# Altium schematic sheet Sht2-V12P0.SchDoc
size E; SheetNumber: 2; SheetTotal: 4
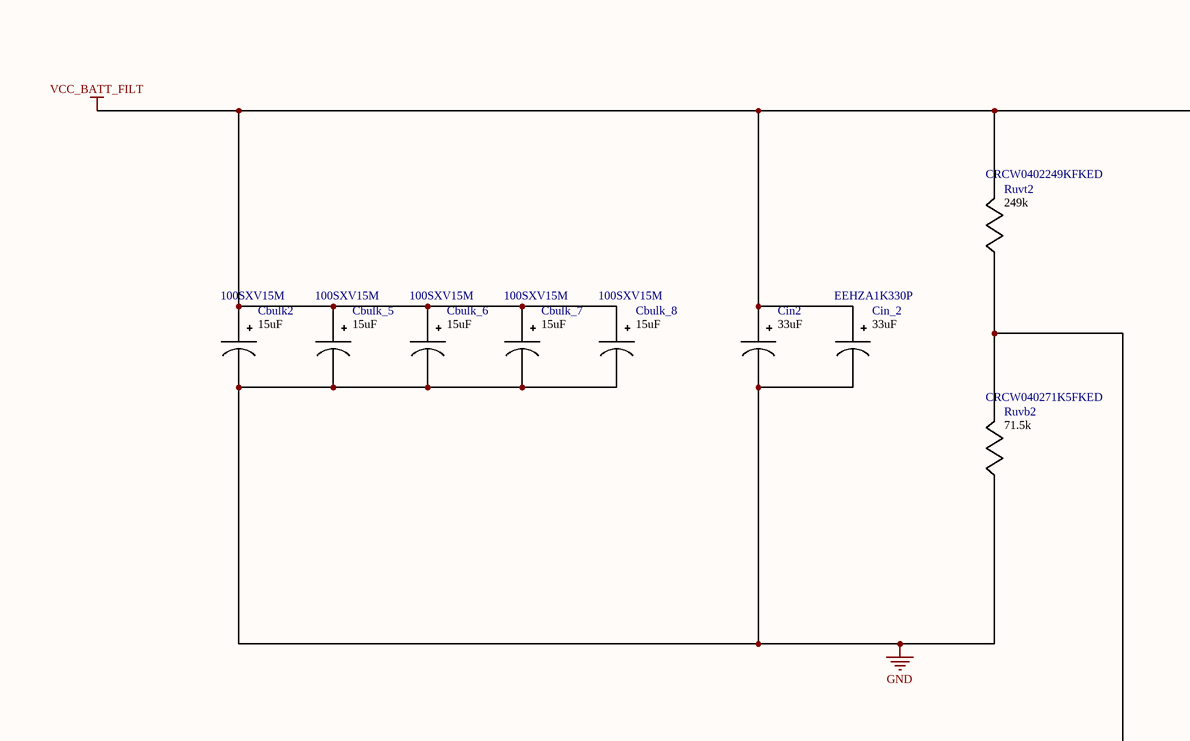
[diagram p0: Sht2-V12P0.SchDoc, top left]
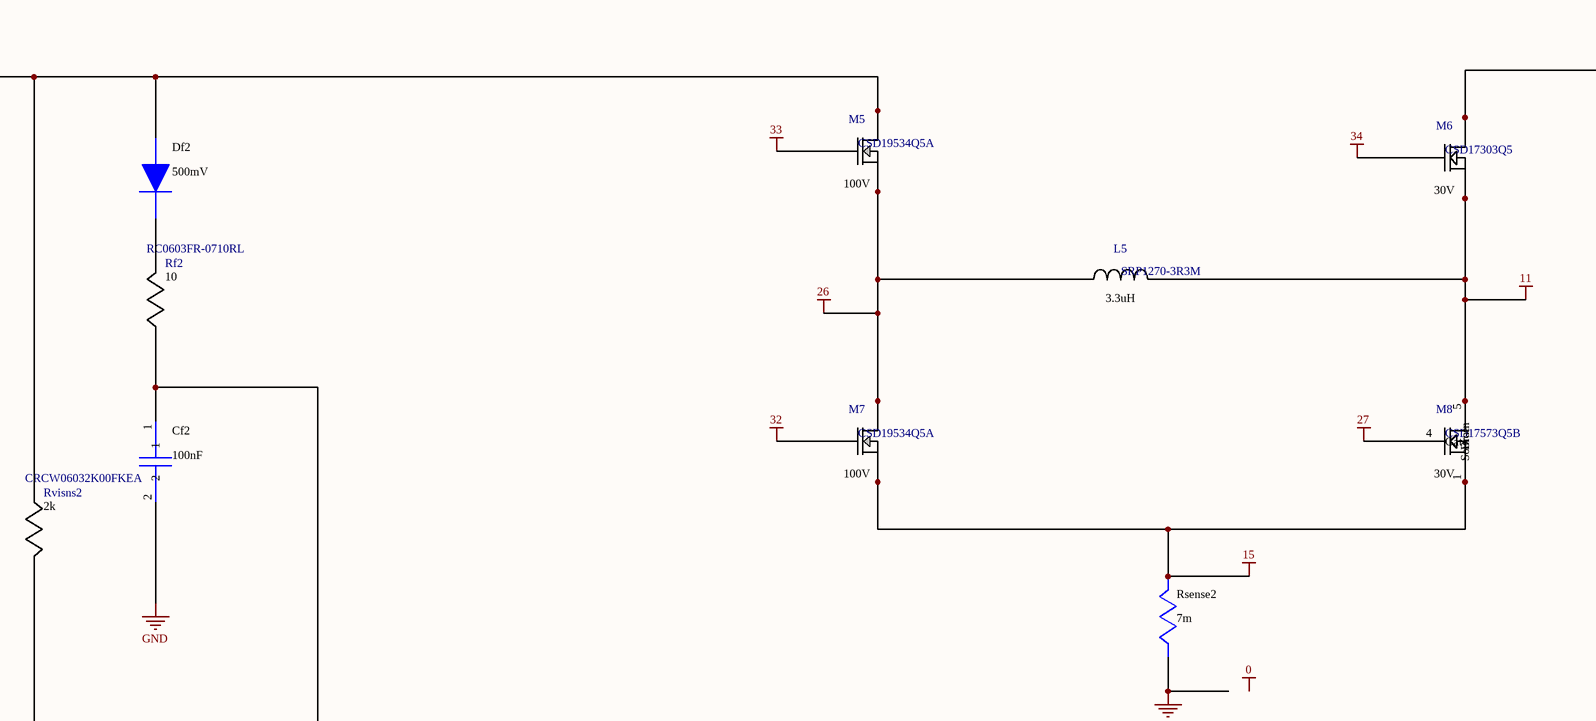
[diagram p1: Sht2-V12P0.SchDoc, top middle]
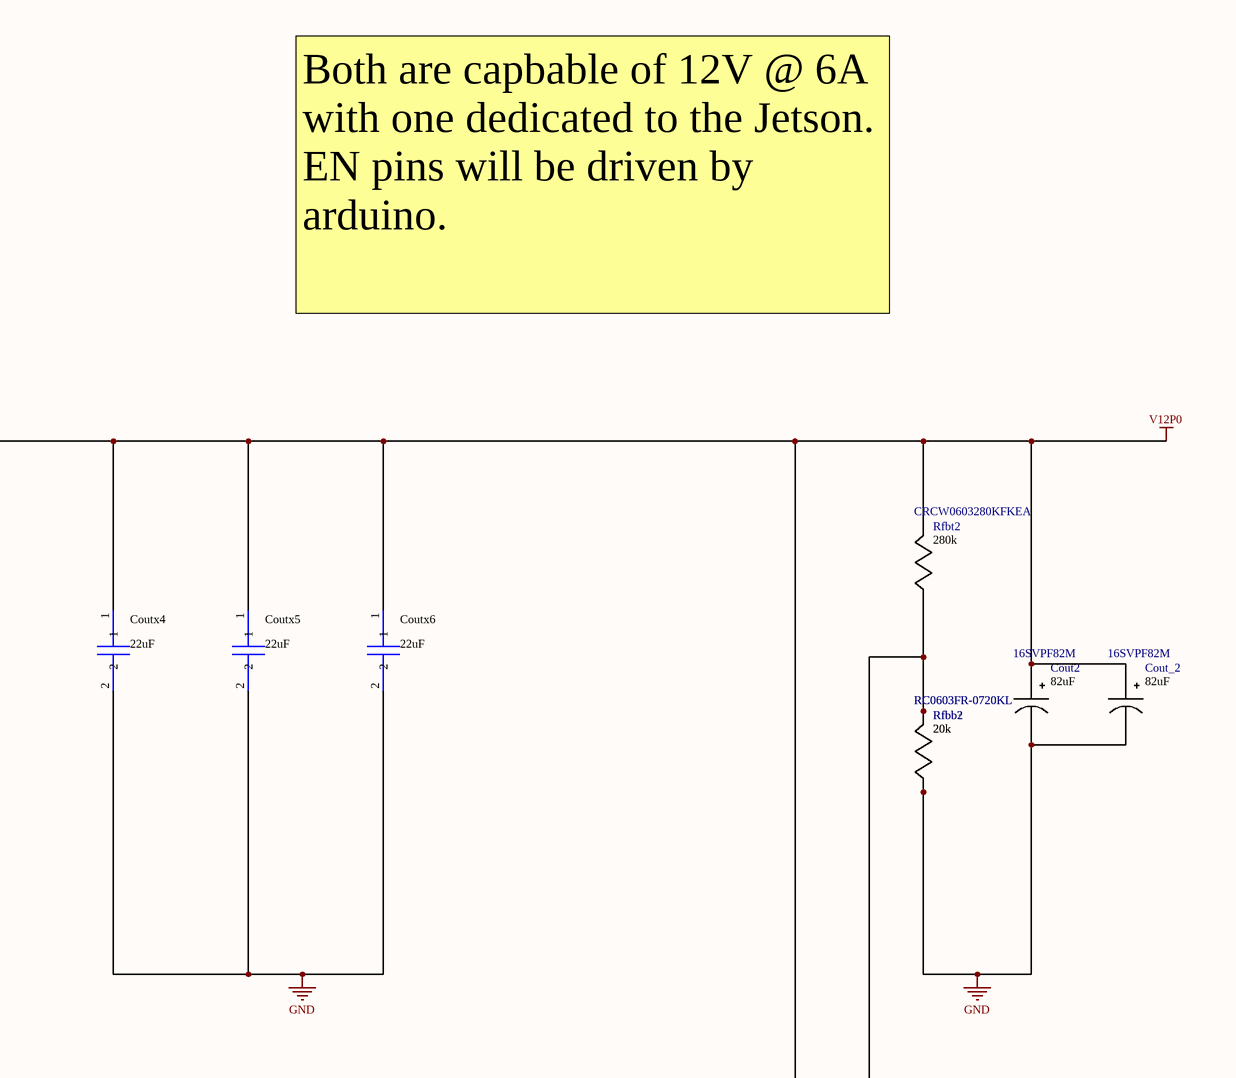
[diagram p2: Sht2-V12P0.SchDoc, top right]
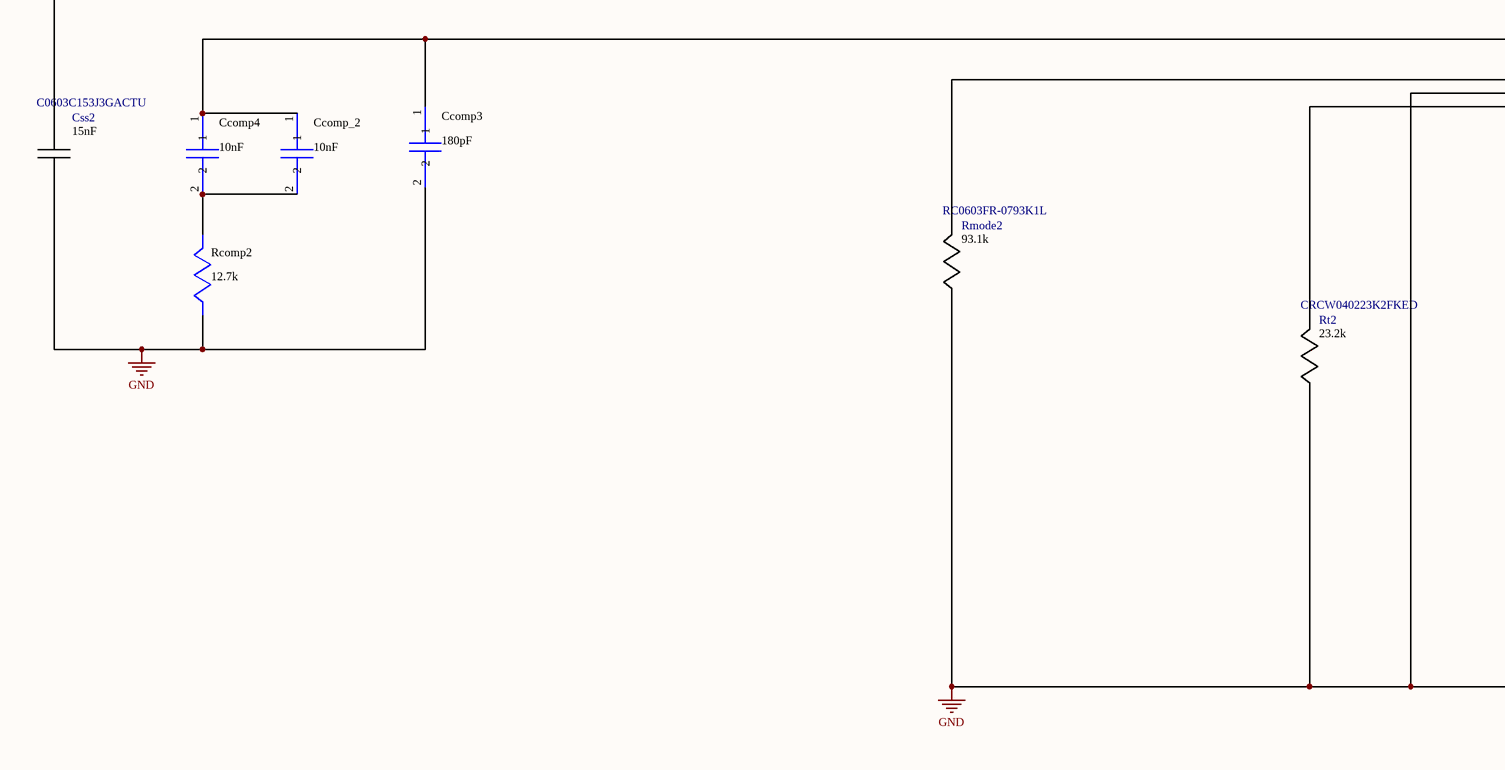
[diagram p3: Sht2-V12P0.SchDoc, bottom left]
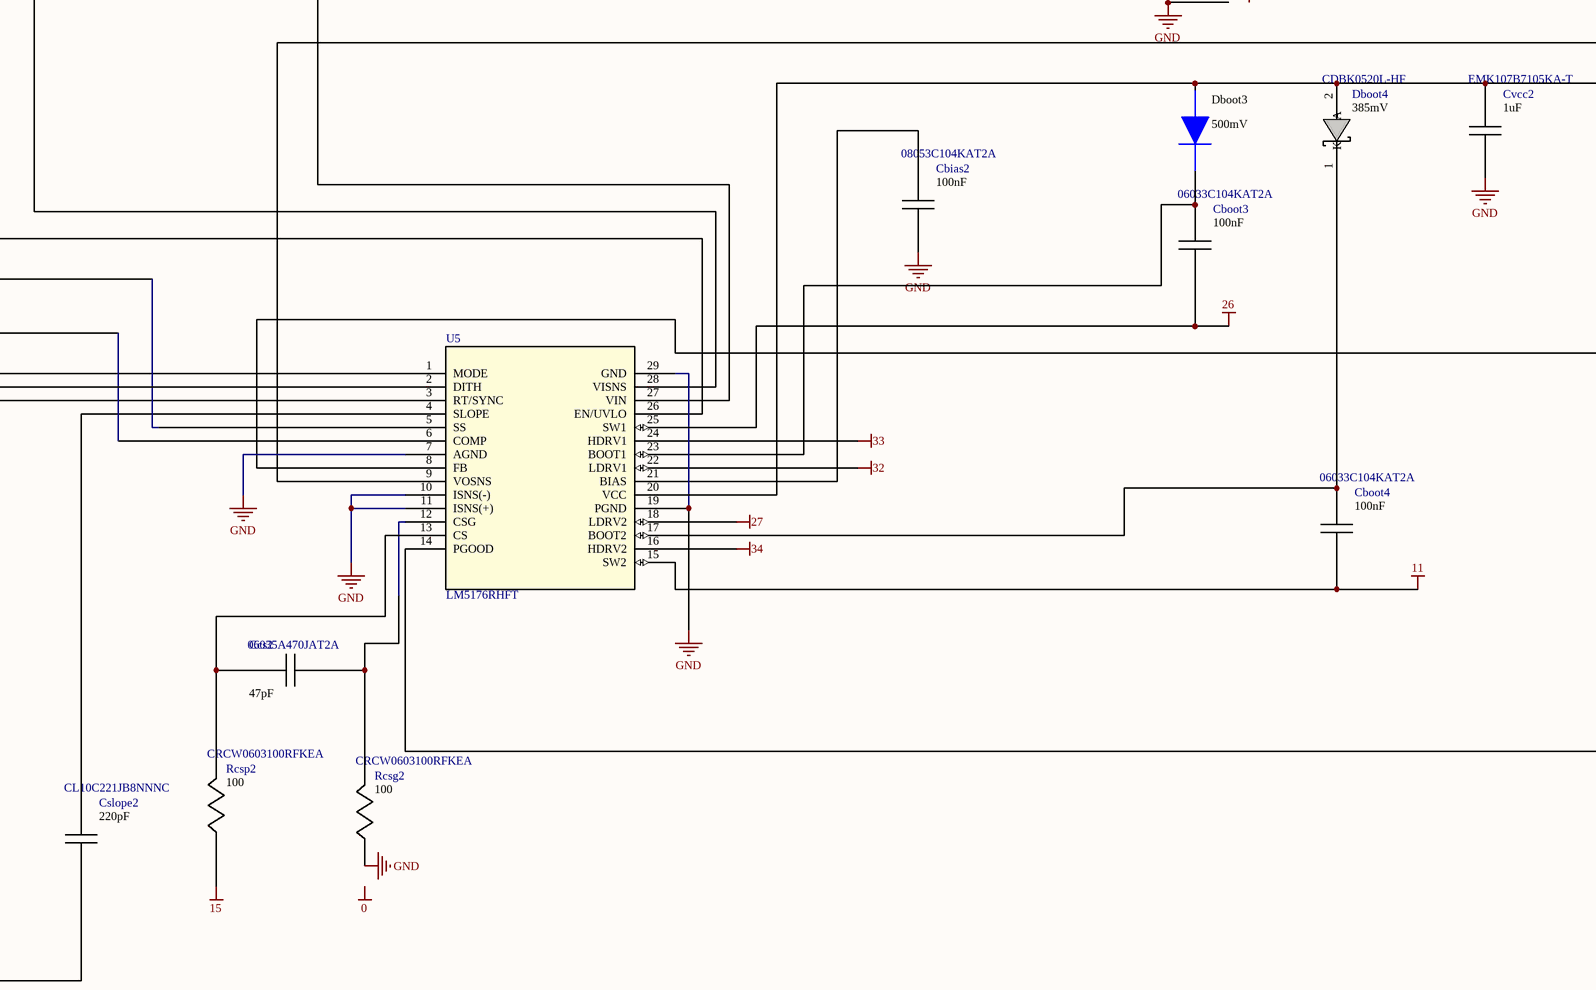
[diagram p4: Sht2-V12P0.SchDoc, bottom middle]
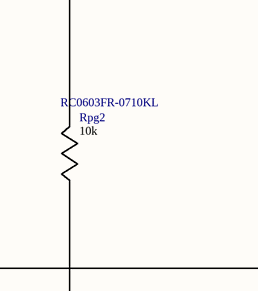
[diagram p5: Sht2-V12P0.SchDoc, bottom right]

## Parts
Cbias2  08053C104KAT2A  value 100nF  [0805]
Cboot3  06033C104KAT2A  value 100nF  [0603]
Cboot4  06033C104KAT2A  value 100nF  [0603]
Cbulk2  100SXV15M  value 15uF  [CAPSMT_62_E12]
Cbulk_5  100SXV15M  value 15uF  [CAPSMT_62_E12]
Cbulk_6  100SXV15M  value 15uF  [CAPSMT_62_E12]
Cbulk_7  100SXV15M  value 15uF  [CAPSMT_62_E12]
Cbulk_8  100SXV15M  value 15uF  [CAPSMT_62_E12]
Ccomp3  value 180pF  [0805]  (hidden comment: C0805C181K5GACTU)
Ccomp4  value 10nF  [0402]  (hidden comment: CGA2B3X7R1H103K050BB)
Ccomp_2  value 10nF  [0402]  (hidden comment: CGA2B3X7R1H103K050BB)
Ccs2  06035A470JAT2A  value 47pF  [0603]
Cf2  value 100nF  [0603]  (hidden comment: CGA3E2X7R1H104K080AA)
Cin2  value 33uF  [SM_RADIAL_10BMM]
Cin_2  EEHZA1K330P  value 33uF  [SM_RADIAL_10BMM]
Cout2  16SVPF82M  value 82uF  [CAPSMT_62_E61]
Cout_2  16SVPF82M  value 82uF  [CAPSMT_62_E61]
Coutx4  value 22uF  [0805]  (hidden comment: C2012X5R1V226M125AC)
Coutx5  value 22uF  [0805]  (hidden comment: C2012X5R1V226M125AC)
Coutx6  value 22uF  [0805]  (hidden comment: C2012X5R1V226M125AC)
Cslope2  CL10C221JB8NNNC  value 220pF  [0603]
Css2  C0603C153J3GACTU  value 15nF  [0603]
Cvcc2  EMK107B7105KA-T  value 1uF  [0603]
Dboot3  value 500mV  [GEN_Diode]  (hidden comment: GENERIC_DIODE)
Dboot4  CDBK0520L-HF  value 385mV  [SOD-123F]
Df2  value 500mV  [GEN_Diode]  (hidden comment: GENERIC_DIODE)
L5  SRP1270-3R3M  value 3.3uH  [SRP1270]
M5  CSD19534Q5A  value 100V  [TRANS_NexFET_Q5A]
M6  CSD17303Q5  value 30V  [TRANS_NexFET_Q5]
M7  CSD19534Q5A  value 100V  [TRANS_NexFET_Q5A]
M8  CSD17573Q5B  value 30V  [DNK0008A]
Rcomp2  value 12.7k  [0402]  (hidden comment: CRCW040212K7FKED)
Rcsg2  CRCW0603100RFKEA  value 100  [0603]
Rcsp2  CRCW0603100RFKEA  value 100  [0603]
Rf2  RC0603FR-0710RL  value 10  [0603]
Rfbb2  RC0603FR-0720KL  value 20k  [0603]
Rfbb?  RC0603FR-0720KL  value 20k  [0603]
Rfbt2  CRCW0603280KFKEA  value 280k  [0603]
Rmode2  RC0603FR-0793K1L  value 93.1k  [0603]
Rpg2  RC0603FR-0710KL  value 10k  [0603]
Rsense2  value 7m  [4527]  (hidden comment: WSR37L000FEA)
Rt2  CRCW040223K2FKED  value 23.2k  [0402]
Ruvb2  CRCW040271K5FKED  value 71.5k  [0402]
Ruvt2  CRCW0402249KFKED  value 249k  [0402]
Rvisns2  CRCW06032K00FKEA  value 2k  [0603]
U5  LM5176RHFT  [VQFN_76RHFT_TEX]

## Nets
11: Cboot4.2 L5.2 M6.1(Source) M6.2(Source) M6.3(Source) M8.5(Drain) M8.6(Drain) M8.7(Drain) M8.8(Drain) M8.9(Drain) U5.15(SW2)
15: M7.1(Source) M7.2(Source) M7.3(Source) M8.1(Source) M8.2(Source) M8.3(Source) Rcsp2.2 Rsense2.1
26: Cboot3.2 L5.1 M5.1(Source) M5.2(Source) M5.3(Source) M7.5(Drain) M7.6(Drain) M7.7(Drain) M7.8(Drain) M7.9(Drain) U5.25(SW1)
27: M8.4(Gate) U5.18(LDRV2)
32: M7.4(Gate) U5.22(LDRV1)
33: M5.4(Gate) U5.24(HDRV1)
34: M6.4(Gate) U5.16(HDRV2)
GND: Cbias2.2 Cbulk2.2(-) Cbulk_5.2(-) Cbulk_6.2(-) Cbulk_7.2(-) Cbulk_8.2(-) Ccomp3.2 Cf2.2 Cin2.2(-) Cin_2.2(-) Cout2.2(-) Cout_2.2(-) Coutx4.2 Coutx5.2 Coutx6.2 Cslope2.2 Css2.2 Cvcc2.2 Rcomp2.2 Rcsg2.2 Rfbb2.2 Rfbb?.2 Rmode2.2 Rsense2.2 Rt2.2 Ruvb2.2 U5.2(DITH) U5.7(AGND) U5.10(ISNS(-)) U5.11(ISNS(+)) U5.19(PGND) U5.29(GND)
V12P0: Cout2.1(+) Cout_2.1(+) Coutx4.1 Coutx5.1 Coutx6.1 M6.5(Drain) M6.6(Drain) M6.7(Drain) M6.8(Drain) M6.9(Drain) Rfbt2.1 U5.9(VOSNS)
VCC_BATT_FILT: Cbulk2.1(+) Cbulk_5.1(+) Cbulk_6.1(+) Cbulk_7.1(+) Cbulk_8.1(+) Cin2.1(+) Cin_2.1(+) Df2.2(A) M5.5(Drain) M5.6(Drain) M5.7(Drain) M5.8(Drain) M5.9(Drain) Ruvt2.1 Rvisns2.2
NetCbias2_1: Cbias2.1 U5.21(BIAS)
NetCboot3_1: Cboot3.1 Dboot3.1(K) U5.23(BOOT1)
NetCboot4_1: Cboot4.1 Dboot4.1(K) U5.17(BOOT2)
NetCcomp3_1: Ccomp3.1 Ccomp4.1 Ccomp_2.1 U5.6(COMP)
NetCcomp4_2: Ccomp4.2 Ccomp_2.2 Rcomp2.1
NetCcs2_1: Ccs2.1 Rcsp2.1 U5.13(CS)
NetCcs2_2: Ccs2.2 Rcsg2.1 U5.12(CSG)
NetCf2_1: Cf2.1 Rf2.2 U5.27(VIN)
NetCslope2_1: Cslope2.1 U5.4(SLOPE)
NetCss2_1: Css2.1 U5.5(SS)
NetCvcc2_1: Cvcc2.1 Dboot3.2(A) Dboot4.2(A) Rpg2.1 U5.20(VCC)
NetDf2_1: Df2.1(K) Rf2.1
NetRfbb2_1: Rfbb2.1 Rfbb?.1 Rfbt2.2 U5.8(FB)
NetRmode2_1: Rmode2.1 U5.1(MODE)
NetRpg2_2: Rpg2.2 U5.14(PGOOD)
NetRt2_1: Rt2.1 U5.3(RT/SYNC)
NetRuvb2_1: Ruvb2.1 Ruvt2.2 U5.26(EN/UVLO)
NetRvisns2_1: Rvisns2.1 U5.28(VISNS)

## Notes on the sheet
- Both are capbable of 12V @ 6A with one dedicated to the Jetson. EN pins will be driven by arduino.
- Labels drawn without touching a wire or pin: 0

## Library data of the parts
Cbias2 = 08053C104KAT2A: Manufacturer Name: AVX; PackageReference: 08053C104KAT2A; Manufacturer Part Number: 08053C104KAT2A
Cboot3 Cboot4 = 06033C104KAT2A: Manufacturer Name: AVX; PackageReference: 06033C104KAT2A; Manufacturer Part Number: 06033C104KAT2A
Cbulk2 Cbulk_5-Cbulk_8 = 100SXV15M: Manufacturer Name: Panasonic; PackageReference: 100SXV15M; Manufacturer Part Number: 100SXV15M
Ccomp3 = C0805C181K5GACTU: Manufacturer Name: Kemet; PackageReference: C0805C181K5GACTU; Manufacturer Part Number: C0805C181K5GACTU
Ccomp4 Ccomp_2 = CGA2B3X7R1H103K050BB: CGA2B3X7R1H103K0; Manufacturer Name: TDK; PackageReference: CGA2B3X7R1H103K050BB; Manufacturer Part Number: CGA2B3X7R1H103K050BB
Ccs2 = 06035A470JAT2A: Manufacturer Name: AVX; PackageReference: 06035A470JAT2A; Manufacturer Part Number: 06035A470JAT2A
Cf2 = CGA3E2X7R1H104K080AA: CGA3E2X7R1H104K0; Manufacturer Name: TDK; PackageReference: CGA3E2X7R1H104K080AA; Manufacturer Part Number: CGA3E2X7R1H104K080AA
Cin2 Cin_2 = EEHZA1K330P: Manufacturer Name: Panasonic; PackageReference: EEHZA1K330P; Manufacturer Part Number: EEHZA1K330P
Cout2 Cout_2 = 16SVPF82M: Manufacturer Name: Panasonic; PackageReference: 16SVPF82M; Manufacturer Part Number: 16SVPF82M
Coutx4-Coutx6 = C2012X5R1V226M125AC: C2012X5R1V226M12; Manufacturer Name: TDK; PackageReference: C2012X5R1V226M125AC; Manufacturer Part Number: C2012X5R1V226M125AC
Cslope2 = CL10C221JB8NNNC: Manufacturer Name: Samsung Electro-Mechanics; PackageReference: CL10C221JB8NNNC; Manufacturer Part Number: CL10C221JB8NNNC
Css2 = C0603C153J3GACTU: Manufacturer Name: Kemet; PackageReference: C0603C153J3GACTU; Manufacturer Part Number: C0603C153J3GACTU
Cvcc2 = EMK107B7105KA-T: Manufacturer Name: Taiyo Yuden; PackageReference: EMK107B7105KA-T; Manufacturer Part Number: EMK107B7105KA-T
Dboot3 = GENERIC_DIODE: CUSTOM1; Manufacturer Name: CUSTOM; PackageReference: CUSTOM; Manufacturer Part Number: GENERIC_DIODE
Dboot4 = CDBK0520L-HF: Manufacturer Name: Comchip Technology; PackageReference: CDBK0520L-HF; Manufacturer Part Number: CDBK0520L-HF
Df2 = GENERIC_DIODE: CUSTOM2; Manufacturer Name: CUSTOM; PackageReference: CUSTOM; Manufacturer Part Number: GENERIC_DIODE
L5 = SRP1270-3R3M: Manufacturer Name: Bourns; PackageReference: SRP1270-3R3M; Manufacturer Part Number: SRP1270-3R3M
M5 M7 = CSD19534Q5A: Manufacturer Name: Texas Instruments; PackageReference: CSD19534Q5A; Manufacturer Part Number: CSD19534Q5A
M6 = CSD17303Q5: Manufacturer Name: Texas Instruments; PackageReference: CSD17303Q5; Manufacturer Part Number: CSD17303Q5
M8 = CSD17573Q5B: CSD17573Q5B- Note out of stock, double check available subs; Manufacturer Name: Texas Instruments; PackageReference: CSD17573Q5B; Manufacturer Part Number: CSD17573Q5B
Rcomp2 = CRCW040212K7FKED: Manufacturer Name: Vishay-Dale; PackageReference: CRCW040212K7FKED; Manufacturer Part Number: CRCW040212K7FKED
Rcsg2 Rcsp2 = CRCW0603100RFKEA: Manufacturer Name: Vishay-Dale; PackageReference: CRCW0603100RFKEA; Manufacturer Part Number: CRCW0603100RFKEA
Rf2 = RC0603FR-0710RL: Manufacturer Name: Yageo; PackageReference: RC0603FR-0710RL; Manufacturer Part Number: RC0603FR-0710RL
Rfbb2 Rfbb? = RC0603FR-0720KL: Manufacturer Name: Yageo; PackageReference: RC0603FR-0720KL; Manufacturer Part Number: RC0603FR-0720KL
Rfbt2 = CRCW0603280KFKEA: Manufacturer Name: Vishay-Dale; PackageReference: CRCW0603280KFKEA; Manufacturer Part Number: CRCW0603280KFKEA
Rmode2 = RC0603FR-0793K1L: Manufacturer Name: Yageo; PackageReference: RC0603FR-0793K1L; Manufacturer Part Number: RC0603FR-0793K1L
Rpg2 = RC0603FR-0710KL: Manufacturer Name: Yageo; PackageReference: RC0603FR-0710KL; Manufacturer Part Number: RC0603FR-0710KL
Rsense2 = WSR37L000FEA: Manufacturer Name: Vishay-Dale; PackageReference: WSR37L000FEA; Manufacturer Part Number: WSR37L000FEA
Rt2 = CRCW040223K2FKED: Manufacturer Name: Vishay-Dale; PackageReference: CRCW040223K2FKED; Manufacturer Part Number: CRCW040223K2FKED
Ruvb2 = CRCW040271K5FKED: Manufacturer Name: Vishay-Dale; PackageReference: CRCW040271K5FKED; Manufacturer Part Number: CRCW040271K5FKED
Ruvt2 = CRCW0402249KFKED: Manufacturer Name: Vishay-Dale; PackageReference: CRCW0402249KFKED; Manufacturer Part Number: CRCW0402249KFKED
Rvisns2 = CRCW06032K00FKEA: Manufacturer Name: Vishay-Dale; PackageReference: CRCW06032K00FKEA; Manufacturer Part Number: CRCW06032K00FKEA
U5 = LM5176RHFT: No Description Available; Mfr_Name: Texas Instruments; Copyright: Copyright (C) 2022 Ultra Librarian. All rights reserved.; Manufacturer_Part_Number: LM5176RHFT; Digi-Key_Part_Number_1: 296-LM5176RHFTTR-ND; Digi-Key_Part_Number_2: 296-LM5176RHFTCT-ND; Digi-Key_Part_Number_3: 296-LM5176RHFTDKR-ND; RefDes: RefDes; Type: DEV